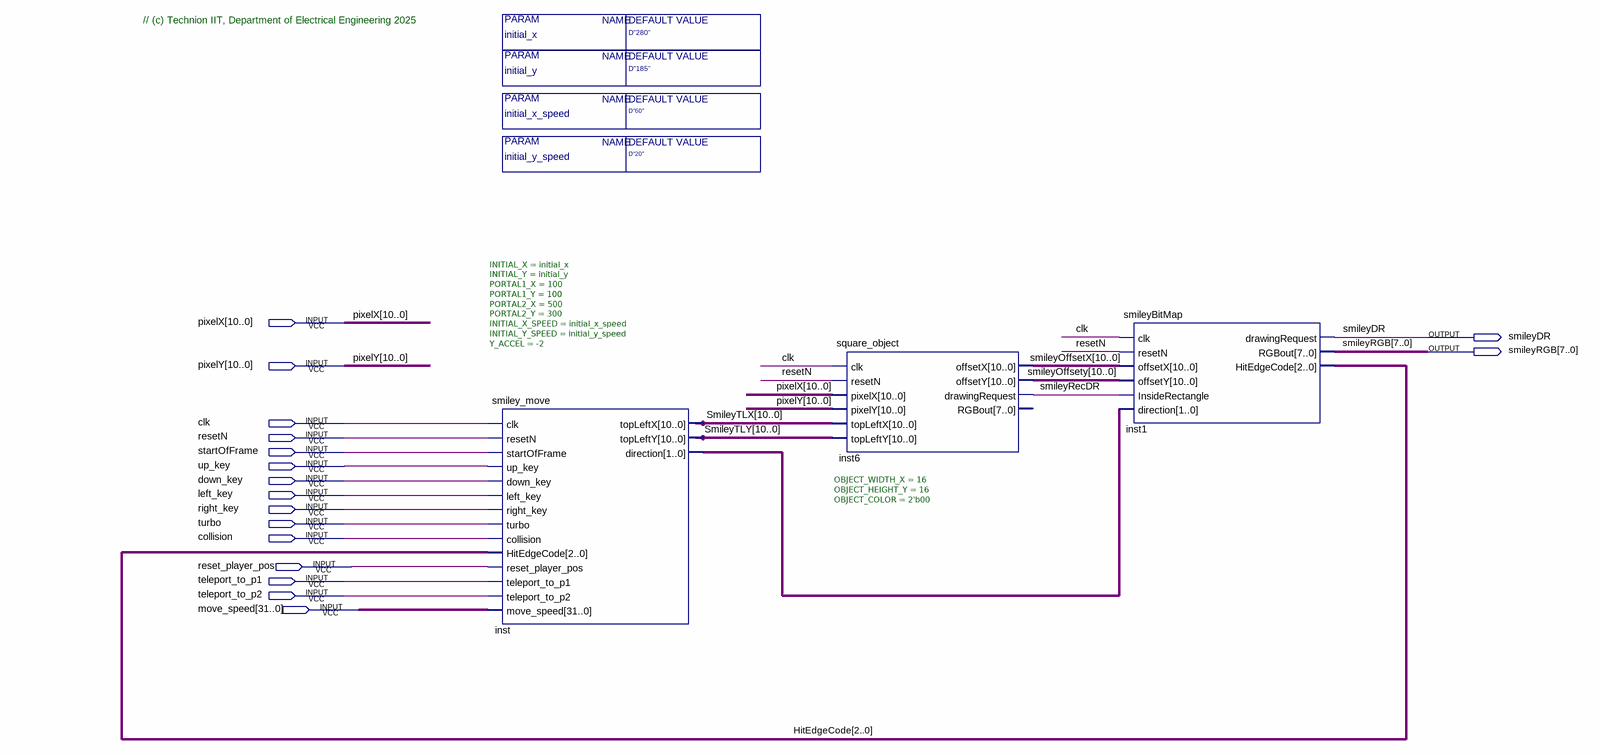
[diagram p0: schematic sheet]
// Quartus schematic Smiley_Block_T.bdf as structural Verilog: 3 symbols, 17 pins
module Smiley_Block_T #(parameter initial_x = "D\"280\"", parameter initial_y = "D\"185\"", parameter initial_x_speed = "D\"60\"", parameter initial_y_speed = "D\"20\"") (
  input  [10:0] pixelX,
  input  [10:0] pixelY,
  input  clk,
  input  resetN,
  input  startOfFrame,
  input  up_key,
  input  down_key,
  input  left_key,
  input  right_key,
  input  turbo,
  input  collision,
  input  reset_player_pos,
  input  teleport_to_p1,
  input  teleport_to_p2,
  input  [31:0] move_speed,
  output smileyDR,
  output [7:0] smileyRGB
);

  wire smileyRecDR;
  wire [1:0] inst_direction;
  wire [2:0] HitEdgeCode;
  wire [10:0] smileyOffsetX, smileyOffsety, SmileyTLX, SmileyTLY;

  smiley_move #(.INITIAL_X(initial_x), .INITIAL_Y(initial_y), .PORTAL1_X(100), .PORTAL1_Y(100), .PORTAL2_X(500), .PORTAL2_Y(300), .INITIAL_X_SPEED(initial_x_speed), .INITIAL_Y_SPEED(initial_y_speed), .Y_ACCEL(-2)) inst (
    .clk(clk), .resetN(resetN), .startOfFrame(startOfFrame), .up_key(up_key), .down_key(down_key),
    .left_key(left_key), .right_key(right_key), .turbo(turbo), .collision(collision),
    .HitEdgeCode(HitEdgeCode), .reset_player_pos(reset_player_pos), .teleport_to_p1(teleport_to_p1),
    .teleport_to_p2(teleport_to_p2), .move_speed(move_speed), .topLeftX(SmileyTLX), .topLeftY(SmileyTLY),
    .direction(inst_direction));
  square_object #(.OBJECT_WIDTH_X(16), .OBJECT_HEIGHT_Y(16), .OBJECT_COLOR(2'b00)) inst6 (
    .clk(clk), .resetN(resetN), .pixelX(pixelX), .pixelY(pixelY), .topLeftX(SmileyTLX), .topLeftY(SmileyTLY),
    .offsetX(smileyOffsetX), .offsetY(smileyOffsety), .drawingRequest(smileyRecDR));  // open: RGBout
  smileyBitMap inst1 (
    .clk(clk), .resetN(resetN), .offsetX(smileyOffsetX), .offsetY(smileyOffsety),
    .InsideRectangle(smileyRecDR), .direction(inst_direction), .drawingRequest(smileyDR), .RGBout(smileyRGB),
    .HitEdgeCode(HitEdgeCode));

  // Notes on the sheet:
  //   // (c) Technion IIT, Department of Electrical Engineering 2025
endmodule
